# EAGLE design TeensyView (EAGLE 7.7.0)
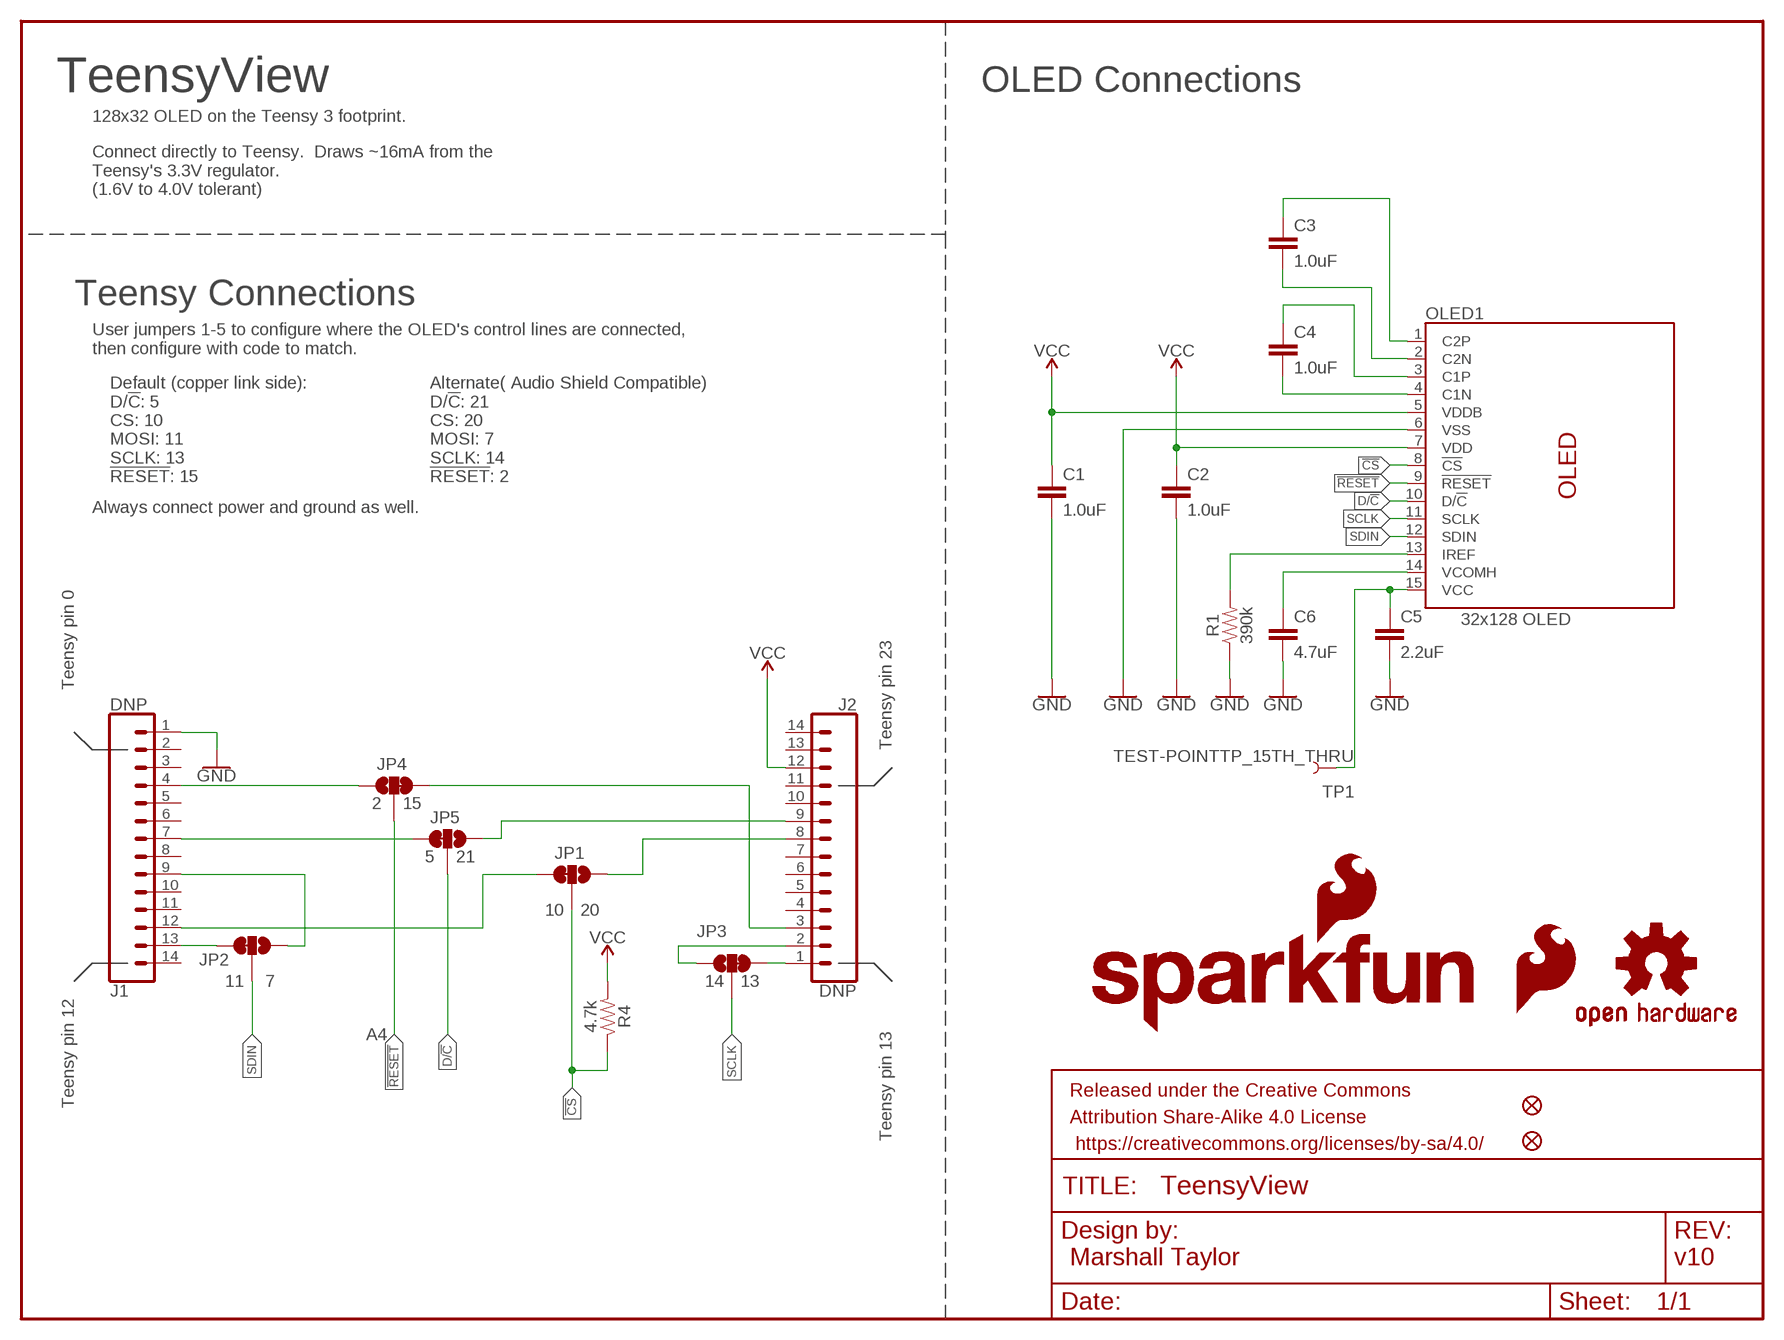
[diagram p0: schematic, sheet 1]

## Parts
C1  1.0uF  1.0UF-0402-16V-10%  [0402]
C2  1.0uF  1.0UF-0402-16V-10%  [0402]
C3  1.0uF  1.0UF-0402-16V-10%  [0402]
C4  1.0uF  1.0UF-0402-16V-10%  [0402]
C5  2.2uF  2.2UF-0805-25V-(+80/-20%)  [0805]
C6  4.7uF  4.7UF-1206-16V-(+80/-20%)  [1206]
FD1  FIDUCIALUFIDUCIAL  [FIDUCIAL-MICRO]
FD2  FIDUCIALUFIDUCIAL  [FIDUCIAL-MICRO]
FRAME1  FRAME-LETTER  [CREATIVE_COMMONS]
J1  DNP  CONN_14NO_SILK  [1X14_NO_SILK]
J2  DNP  CONN_14NO_SILK  [1X14_NO_SILK]
JP1  JUMPER-SMT_3_1-NC_TRACE_SILK  [SMT-JUMPER_3_1-NC_TRACE_SILK]
JP2  JUMPER-SMT_3_1-NC_TRACE_SILK  [SMT-JUMPER_3_1-NC_TRACE_SILK]
JP3  JUMPER-SMT_3_1-NC_TRACE_SILK  [SMT-JUMPER_3_1-NC_TRACE_SILK]
JP4  JUMPER-SMT_3_1-NC_TRACE_SILK  [SMT-JUMPER_3_1-NC_TRACE_SILK]
JP5  JUMPER-SMT_3_1-NC_TRACE_SILK  [SMT-JUMPER_3_1-NC_TRACE_SILK]
LOGO1  SFE_LOGO_FLAME.1_INCH  [SFE_LOGO_FLAME_.1]
LOGO2  OSHW-LOGOS  [OSHW-LOGO-S]
LOGO3  SFE_LOGO_NAME_FLAME.1_INCH  [SFE_LOGO_NAME_FLAME_.1]
OLED1  32x128 OLED  OLED128X64SIDEREAR-MOUNT  [OLED-UG-2832TSWGG01-REAR]
R1  390k  390KOHM-0603-1/10W-1%  [0603]
R4  4.7k  4.7KOHM-0603-1/10W-1%  [0603]
TP1  TEST-POINTTP_15TH_THRU  [TP_15TH]

## Nets
!CS: JP1.2 OLED1.8(!CS!) R4.1
!RESET: JP4.2 OLED1.9(!RESET!)
D/!C: JP5.2 OLED1.10(D/!C!)
GND: C1.2 C2.2 C5.2 C6.2 J1.1 OLED1.6(VSS) R1.1
N$1: J1.12 JP1.3
N$2: J2.8 JP1.1
N$3: C4.2 OLED1.4(C1N)
N$4: C4.1 OLED1.3(C1P)
N$5: C3.2 OLED1.2(C2N)
N$6: C3.1 OLED1.1(C2P)
N$7: OLED1.13(IREF) R1.2
N$8: C6.1 OLED1.14(VCOMH)
N$9: C5.1 OLED1.15(VCC) TP1.P$1
N$10: J2.1 JP3.3
N$11: J2.2 JP3.1
N$12: J1.13 JP2.3
N$13: J1.9 JP2.1
N$14: J2.3 JP4.3
N$15: J1.4 JP4.1
N$16: J1.7 JP5.3
N$17: J2.9 JP5.1
SCLK: JP3.2 OLED1.11(SCLK)
SDIN: JP2.2 OLED1.12(SDIN)
VCC: C1.1 C2.1 J2.12 OLED1.5(VDDB) OLED1.7(VDD) R4.2
Unconnected: J1.2 J1.3 J1.5 J1.6 J1.8 J1.10 J1.11 J1.14 J2.4 J2.5 J2.6 J2.7 J2.10 J2.11 J2.13 J2.14

## Notes on the sheet
- TeensyView | OLED Connections
- 128x32 OLED on the Teensy 3 footprint.
- Connect directly to Teensy.  Draws ~16mA from the
  Teensy's 3.3V regulator.
  (1.6V to 4.0V tolerant)
- Teensy Connections
- User jumpers 1-5 to configure where the OLED's control lines are connected,
  then configure with code to match.
- Default (copper link side):
  D/!C!: 5
  CS: 10
  MOSI: 11
  SCLK: 13
  !RESET!: 15
- Alternate( Audio Shield Compatible)
  D/!C!: 21
  CS: 20
  MOSI: 7
  SCLK: 14
  !RESET!: 2
- Always connect power and ground as well.
- Teensy pin 0
- Teensy pin 23
- 2 | 15
- 5 | 21
- 10 | 20
- 11 | 7 | 14 | 13
- Teensy pin 12
- A4
- Teensy pin 13
- Marshall Taylor | v10

## Library data of the parts
C1-C4 = SparkFun-Capacitors:1.0UF: 1µF ceramic capacitors A capacitor is a passive two-terminal electrical component used to store electrical energy temporarily in an electric field.; PROD_ID: CAP-12417
C5 = SparkFun-Capacitors:2.2UF: 2.2µF ceramic capacitors A capacitor is a passive two-terminal electrical component used to store electrical energy temporarily in an electric field.; PROD_ID: CAP-11624
C6 = SparkFun-Capacitors:4.7UF: 4.7µF ceramic capacitors A capacitor is a passive two-terminal electrical component used to store electrical energy temporarily in an electric field.; PROD_ID: CAP-10300
FD1 FD2 = SparkFun-Aesthetics:FIDUCIAL: Fiducial Alignment Points Point-of-reference for pick-and-place machines and other optical instruments.
FRAME1 = SparkFun-Aesthetics:FRAME-LETTER: Schematic Frame - Letter Standard 8.5x11 US Letter frame
J1 J2 = SparkFun-Connectors:CONN_14: Multi connection point. Often used as Generic Header-pin footprint for 0.1 inch spaced/style header connections On any of the 0.1 inch spaced packages, you can populate with these: Break Away Headers - Straight <https://www.sparkfun.com/products/116> (PRT-00116) Break Away Male Headers - Right Angle <https://www.sparkfun.com/products/553> (PRT-00553) Female Headers <https://www.sparkfun.com/products/115> (PRT-00115) Break Away Headers - Machine Pin <https://www.sparkfun.com/products/117> (PRT-00117) Break Away Female Headers - Swiss Machine Pin <https://www.sparkfun.com/products/743> (PRT-00743) For SCREWTERMINALS and SPRING TERMINALS visit here: Screw Terimnals on SparkFun.com <https://www.sparkfun.com/search/results?term=Screw+Terminals> (5mm/3.5mm/2.54mm spacing) This device is also useful as a general connection point to wire up your design to another part of your project. Our various solder wires solder well into these plated through hole pads. Hook-Up Wire - Assortment (Stranded, 22 AWG) <https://www.sparkfun.com/products/11375> (PRT-11375) Hook-Up Wire - Assortment (Solid Core, 22 AWG) <https://www.sparkfun.com/products/11367> (PRT-11367) View the entire wire category on our website here <https://www.sparkfun.com/categories/141> Special notes: Molex polarized connector foot print use with SKU : PRT-08231 with associated crimp pins and housings. 1MM SMD Version SKU: PRT-10208 NOTES ON THE VARIANTS LOCK and LOCK_LONGPADS... This footprint was designed to help hold the alignment of a through-hole component (i.e. 6-pin header) while soldering it into place. You may notice that each hole has been shifted either up or down by 0.005 of an inch from it's more standard position (which is a perfectly straight line). This slight alteration caused the pins (the squares in the middle) to touch the edges of the holes. Because they are alternating, it causes a "brace" to hold the component in place. 0.005 has proven to be the perfect amount of "off-center" position when using our standard breakaway headers. Although looks a little odd when you look at the bare footprint, once you have a header in there, the alteration is very hard to notice. Also,if you push a header all the way into place, it is covered up entirely on the bottom side.
JP1-JP5 = SparkFun-Jumpers:JUMPER-SMT_3_1-NC_TRACE: Normally closed trace jumper (1 of 2 connections) This jumper has a trace between two pads so it's normally closed (NC). The other connection is normally open (NO). Use a razor knife to open the connection. For best results follow the IPC guidelines for cutting traces: Cutout at least 0.063 mm (0.005 in). Remove all loose material to clean up the cut area. Seal the cut with an approved epoxy. Reapply solder to reclose the connection, or to close the NO connection.
LOGO1 = SparkFun-Aesthetics:SFE_LOGO_FLAME: SparkFun Flame Logo This is the SparkFun flame logo. The logo on the schematic will always be the same size; the package variant is the height of the flame. Default layer for the logo on the board is tSilk.
LOGO2 = SparkFun-Aesthetics:OSHW-LOGO: Open-Source Hardware (OSHW) Logo This logo indicates the piece of hardware it is found on incorporates a OSHW license and/or adheres to the definition of open source hardware found here: http://freedomdefined.org/OSHW
LOGO3 = SparkFun-Aesthetics:SFE_LOGO_NAME_FLAME: SparkFun Font Logo w/ Flame This is the SparkFun full logo. The logo on the schematic will always be the same size; the package variant is the height of the flame part of the logo. Default layer for the logo on the board is tSilk.
OLED1 = TeensyViewDev:OLED128X64SIDE: Micro OLED TODO: Add description SparkFun Products: Product <https://www.sparkfun.com/products/13003>; PROD_ID: LCD-13577
R1 = SparkFun-Resistors:390KOHM: 390kΩ resistor A resistor is a passive two-terminal electrical component that implements electrical resistance as a circuit element. Resistors act to reduce current flow, and, at the same time, act to lower voltage levels within circuits. - Wikipedia; PROD_ID: RES-12024
R4 = SparkFun-Resistors:4.7KOHM: 4.7kΩ resistor A resistor is a passive two-terminal electrical component that implements electrical resistance as a circuit element. Resistors act to reduce current flow, and, at the same time, act to lower voltage levels within circuits. - Wikipedia; PROD_ID: RES-07857
TP1 = SparkFun-Connectors:TEST-POINT: SparkFun Test Points Bare copper test points for troubleshooting or In-Circuit-Testing. These are used by our Production team for verifying production board runs using pogo-pins on test beds. SparkFun Products: SparkFun LSM9DS1 Breakout <https://www.sparkfun.com/products/13284> SparkFun PSOC <https://www.sparkfun.com/products/13714> SparkFun Load Cell Amplifier <https://www.sparkfun.com/products/13879>

## Board
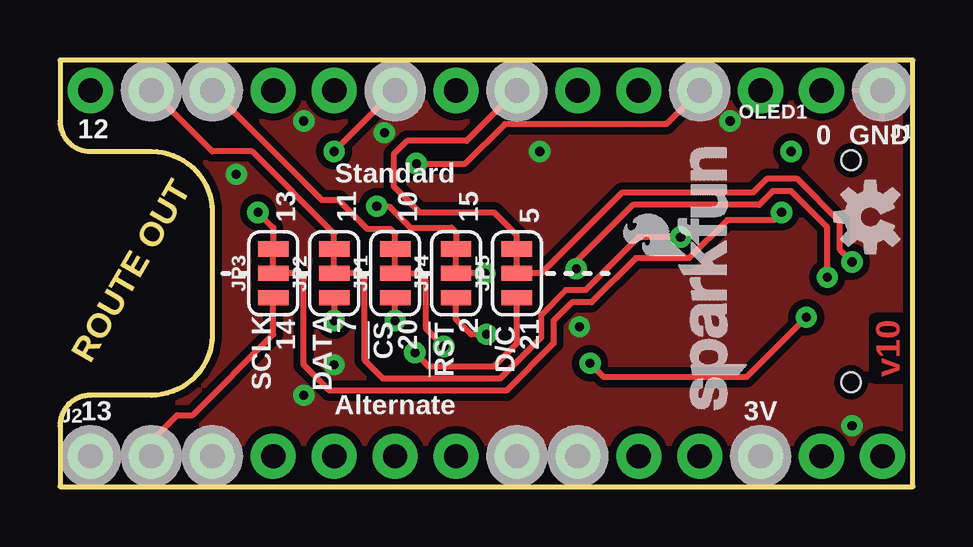
[diagram p1: board, top side]
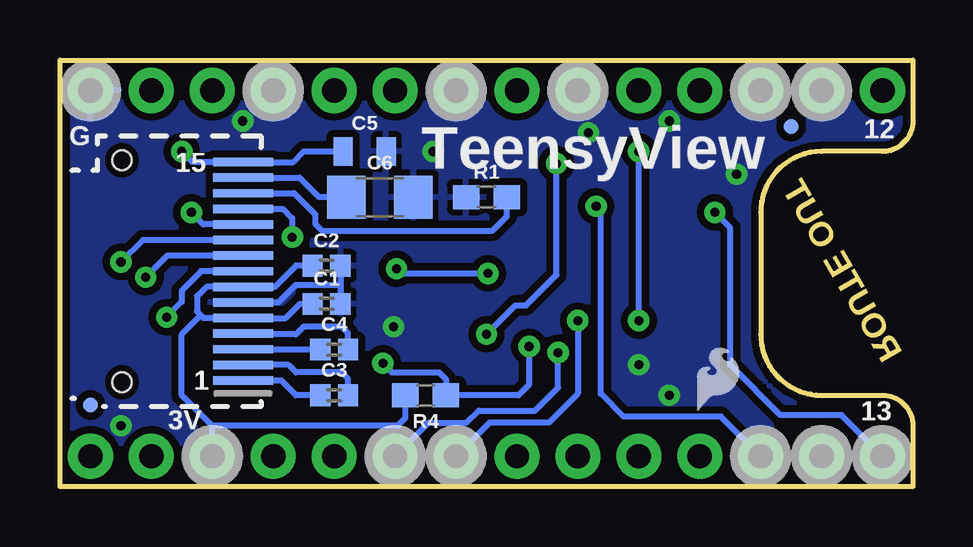
[diagram p2: board, bottom side, seen from below]

Size 35.56 x 17.78 mm. Coordinates in mm from the lower left corner, seen from the top.
Outline: 0,0 35.56,0 35.56,17.78 0,17.78 0,15.24 arc90 1.27,13.97 3.81,13.97 arc-90 6.35,11.43 6.35,6.35 arc-90 3.81,3.81 1.27,3.81 arc90 0,2.54 0,0
Copper layers (1*16): Top 0.035mm / dielectric 1.5mm / Bottom 0.035mm
Design rules "SparkFun-2-layer-STANDARD": minimum track width 10mil, minimum drill 20mil, track to track 10mil, track to pad 8mil, pad to pad 8mil, via to via 10mil, smd to smd 8mil, copper to edge 8mil, drill to drill 8mil, minimum pad ring 10mil, minimum via ring 10mil, stop-mask expansion 4mil, vias tented up to drill 25mil, thermal gap 10mil

### Footprints (pad centres in the part's own frame; a part is rotated, then mirrored left to right if it is on the bottom)
0402 = smd 0.85 x 0.9: 1 -0.58,0; 2 0.58,0
0805 = smd 0.8 x 1.2: 1 -0.9,0; 2 0.9,0
1206 = smd 1.6 x 1.8: 1 -1.4,0; 2 1.4,0
FIDUCIAL-MICRO = smd 0.635 x 0.635: 1 0,0
1X14_NO_SILK = drill 1.016 pad 1.88: 1 0,0; 2 2.54,0; 3 5.08,0; 4 7.62,0; 5 10.16,0; 6 12.7,0; 7 15.24,0; 8 17.78,0; 9 20.32,0; 10 22.86,0; 11 25.4,0; 12 27.94,0; 13 30.48,0; 14 33.02,0
SMT-JUMPER_3_1-NC_TRACE_SILK = smd 0.635 x 1.27: 1 -1.016,0; 2 0,0; 3 1.016,0
OLED-UG-2832TSWGG01-REAR = smd 2.5 x 0.35 bottom: 1 0.75,-10.175; 2 0.75,-9.525; 3 0.75,-8.875; 4 0.75,-8.225; 5 0.75,-7.575; 6 0.75,-6.925; 7 0.75,-6.275; 8 0.75,-5.625; 9 0.75,-4.975; 10 0.75,-4.325; 11 0.75,-3.675; 12 0.75,-3.025; 13 0.75,-2.375; 14 0.75,-1.725; 15 0.75,-1.075 | hole 0.8: 5.8,-1; 5.8,-10.25
0603 = smd 1.1 x 1: 1 -0.85,0; 2 0.85,0
TP_15TH = drill 0.381 pad 0.61: P$1 0,0

### Placement (x,y rotation side)
C1  24.45,7.62 0 bottom
C2  24.45,9.21 0 bottom
C3  24.13,3.81 0 bottom
C4  24.13,5.71 0 bottom
C5  22.86,13.97 0 bottom
C6  22.23,12.06 0 bottom
FD1  34.29,3.41 0 bottom
FD2  5.08,15 0 bottom
FRAME1  -13.97,-24.13 0 top  (outside the outline)
J1  34.29,16.51 180 top
J2  1.27,1.27 0 top
JP1  13.97,8.89 90 top
JP2  11.43,8.89 90 top
JP3  8.89,8.89 90 top
JP4  16.51,8.89 90 top
JP5  19.05,8.89 90 top
LOGO1  9.29,2.86 0 bottom
LOGO2  33.78,11.24 90 top
LOGO3  28.69,2.79 90 top
OLED1  27.18,14.61 0 top
R1  17.78,12.06 0 bottom
R4  20.32,3.81 180 bottom
TP1  30.48,13.97 0 bottom

### Tracks (layer width: path | path; a pad name or v marks a point on that pad's centre or on a via)
!CS  (via drill 0.38)
  Top 0.254: v31.11,7.06 28.61,4.56 22.68,4.56 v22.1,5.14 | JP1.2 14.92,8.89 15.24,8.57 15.24,6.6 v16,5.84
  Bottom 0.254: OLED1.8 29.68,8.98 30.48,8.18 30.48,7.7 v31.11,7.06 | v22.1,5.14 21.72,4.76 19.75,4.76 19.47,4.48 R4.1 16.45,3.81 16,4.25 v16,5.84
!RESET  (via drill 0.38)
  Top 0.254: v17.72,8.89 JP4.2 | v21.53,9.08 21.53,9.4 23.88,11.75 29.15,11.75 29.72,12.32 30.48,12.32 31.99,10.81 v31.99,8.73
  Bottom 0.254: OLED1.9 31.09,9.63 v31.99,8.73 | v21.53,9.08 21.34,8.89 v17.72,8.89
D/!C  (via drill 0.38)
  Top 0.254: JP5.2 20.07,8.89 23.43,12.26 28.89,12.26 29.46,12.83 30.73,12.83 32.51,11.05 32.51,9.87 v33.02,9.37
  Bottom 0.254: OLED1.10 32.11,10.28 v33.02,9.37
GND  (via drill 0.38)
  Bottom 0.254: C2.2 23.87,8.41 | 23.87,8.41 C1.2 | OLED1.6 26.45,7.68 25.72,8.41 23.87,8.41
  other vias: 10.16,3.81 13.53,14.75 11.43,5.08 20,13.97 33.02,2.54 21.65,6.67 7.35,13.02 27.94,15.24 10.16,15.24
  pour Top (isolate 0.305): 0,17.78 35.56,17.78 35.56,0 0,0
  pour Bottom (isolate 0.305): 35.56,17.78 0,17.78 0,0 35.56,0
N$1
  Top 0.254: JP1.3 13.97,10.54 13.78,10.73 12.83,10.73 11.62,11.94 10.92,11.94 J1.12
N$2  (via drill 0.38)
  Top 0.254: v13.97,6.92 JP1.1
  Bottom 0.254: v13.97,6.92 13.97,3.87 15.18,2.67 17.65,2.67 J2.8
N$3
  Bottom 0.254: C4.2 23.55,6.41 23.81,6.67 25.4,6.67 25.72,6.35 27.9,6.35 OLED1.4
N$4
  Bottom 0.254: OLED1.3 24.73,5.73 C4.1
N$5
  Bottom 0.254: C3.2 23.55,4.5 23.81,4.76 25.72,4.76 26.04,5.08 OLED1.2
N$6
  Bottom 0.254: OLED1.1 26.34,4.43 25.72,3.81 C3.1
N$7
  Bottom 0.254: OLED1.13 25.8,12.23 24.92,11.35 24.92,10.95 24.64,10.67 17.53,10.67 16.93,11.26 R1.2
N$8
  Bottom 0.254: OLED1.14 25.58,12.88 24.77,12.06 C6.1
N$9
  Bottom 0.254: C5.1 25.4,13.97 25.84,13.53 OLED1.15 30.04,13.53 TP1.P$1
N$10  (via drill 0.38)
  Top 0.254: v8.26,11.43 8.89,10.79 JP3.3
  Bottom 0.254: J2.1 2.98,2.98 5.52,2.98 7.62,5.08 7.62,10.79 v8.26,11.43
N$11
  Top 0.254: J2.2 3.81,1.91 4.89,2.98 5.52,2.98 8.89,6.35 JP3.1
N$12
  Top 0.254: JP2.3 11.43,10.54 8,13.97 6.35,13.97 J1.13
N$13  (via drill 0.38)
  Top 0.254: JP2.1 v11.43,6.92 | v11.43,13.97 J1.9
  Bottom 0.254: v11.43,6.92 v11.43,13.97
N$14  (via drill 0.38)
  Top 0.254: v13.21,11.68 13.72,11.68 14.61,10.79 16.32,10.79 16.51,10.6 JP4.3
  Bottom 0.254: J2.3 8,2.92 12.06,2.92 13.02,3.87 13.02,11.49 v13.21,11.68
N$15  (via drill 0.38)
  Top 0.254: J1.4 25.27,15.11 18.54,15.11 16.89,13.46 v14.86,13.46 | v17.78,6.35 17.14,6.35 16.51,6.99 JP4.1
  Bottom 0.254: v17.78,6.35 16.57,7.56 16.13,7.56 14.86,8.83 v14.86,13.46
N$16
  Top 0.254: JP5.3 19.05,10.48 18.1,11.43 14.99,11.43 13.91,12.51 13.91,13.84 14.48,14.41 16.95,14.41 J1.7
N$17  (via drill 0.38)
  Top 0.254: JP5.1 19.05,5.97 18.1,5.02 15.37,5.02 v14.8,5.59
  Bottom 0.254: J2.9 20.19,2.67 18.61,2.67 18.1,3.17 15.75,3.17 14.8,4.13 v14.8,5.59
SCLK  (via drill 0.38)
  Top 0.254: v30.08,11.43 29.77,11.11 27.81,11.11 26.23,9.53 24,9.53 22.16,7.68 21.34,7.68 20.57,6.92 20.57,5.97 18.61,4 11.24,4 10.16,5.08 10.16,8.64 9.91,8.89 JP3.2
  Bottom 0.254: OLED1.11 29.58,10.93 v30.08,11.43
SDIN  (via drill 0.38)
  Top 0.254: v25.88,10.4 24.11,10.4 21.91,8.19 21.08,8.19 20.07,7.18 20.07,6.22 18.35,4.51 13.46,4.51 12.7,5.27 12.7,8.64 12.45,8.89 JP2.2
  Bottom 0.254: OLED1.12 26.26,11.58 25.88,11.19 v25.88,10.4
VCC
  Bottom 0.254: 29.69,7.14 29.57,7.03 OLED1.5 26.15,7.03 25.56,7.62 C1.1 | 29.69,7.14 29.84,7.3 29.84,7.94 29.45,8.33 OLED1.7 26.59,8.33 25.72,9.21 C2.1 | J2.12 29.21,2.54 | 29.21,2.54 30.48,3.81 30.48,6.35 29.69,7.14 | 29.21,2.54 21.48,2.54 21.17,2.85 R4.2

### Text on the board
Top: v10
Dimension: ROUTE OUT
tPlace: 12 | 0 | GND | Standard | 13 | 11 | 10 | 15 | 5 | 7 | 2 | SCLK | 14 | DATA | !CS | 20 | !RST | D/!C | 21 | 13 | Alternate | 3V
bPlace: 12 | G | TeensyView | 15 | 1 | 13 | 3V
Measures: Measurements in inches
tDocu: Marshall Taylor